# EAGLE design FT231X (EAGLE 7.5.0)
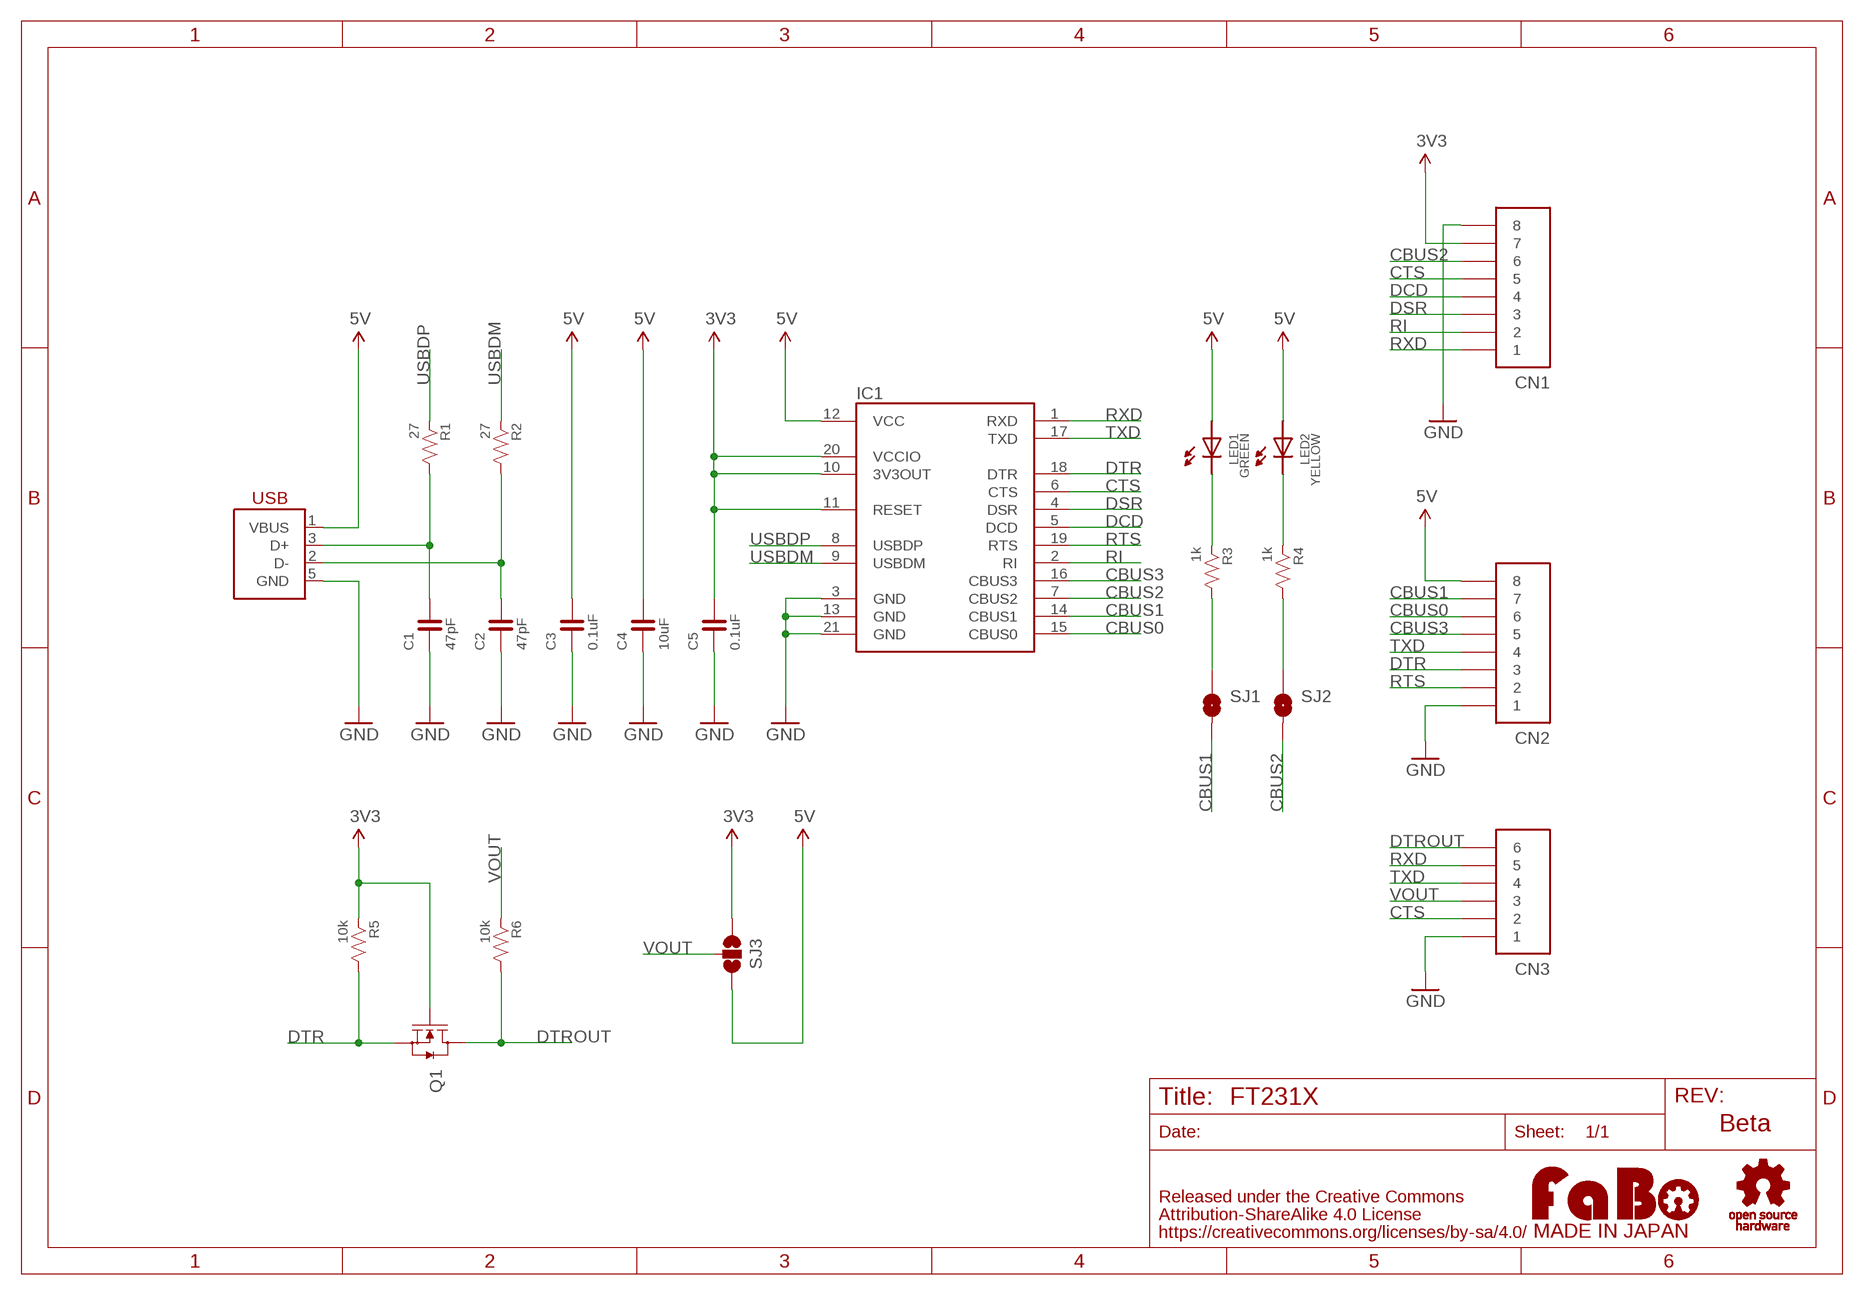
[diagram p0: schematic, sheet 1]

## Parts
C1  47pF  CAPACITOR-0603  [0603]
C2  47pF  CAPACITOR-0603  [0603]
C3  0.1uF  CAPACITOR-0603  [0603]
C4  10uF  CAPACITOR-0603  [0603]
C5  0.1uF  CAPACITOR-0603  [0603]
CN1  PIN_HEADER_1X8-SNEAKY  [PIN_1X8_SNEAKY]
CN2  PIN_HEADER_1X8-SNEAKY  [PIN_1X8_SNEAKY]
CN3  PIN_HEADER_1X6-SNEAKY  [PIN_1X6_SNEAKY]
IC1  FT231XQ  [QFN-20]
LED1  GREEN  LED-0603  [0603]
LED2  YELLOW  LED-0603  [0603]
Q1  MOSFET-N-BSS138  [SOT23-3]
R1  27  RESISTOR-0603  [0603]
R2  27  RESISTOR-0603  [0603]
R3  1k  RESISTOR-0603  [0603]
R4  1k  RESISTOR-0603  [0603]
R5  10k  RESISTOR-0603  [0603]
R6  10k  RESISTOR-0603  [0603]
SJ1  SMD-JUMPER-2_SHORT  [SMD-JUMPER-2-SHORT]
SJ2  SMD-JUMPER-2_SHORT  [SMD-JUMPER-2-SHORT]
SJ3  SMD-JUMPER-3_23SHORT  [SMD-JUMPER-3-23SHORT]
U$2  LOGO_OSHW-T_M_BOTTOM  [LOGO_OSHW_T_MS_BOTTOM]
U$3  LOGO_FABO-S  [LOGO_FABO_S]
USB1  USB-MICRO_B_SMT  [DX4R005JJ2R1800]

## Nets
3V3: C5.2 CN1.7 IC1.10(3V3OUT) IC1.11(RESET) IC1.20(VCCIO) Q1.1(G) R5.1 SJ3.1
5V: C3.2 C4.2 CN2.8 IC1.12(VCC) LED1.ANODE LED2.ANODE SJ3.3 USB1.1(VBUS)
CBUS0: CN2.6 IC1.15(CBUS0)
CBUS1: CN2.7 IC1.14(CBUS1) SJ1.2
CBUS2: CN1.6 IC1.7(CBUS2) SJ2.2
CBUS3: CN2.5 IC1.16(CBUS3)
CTS: CN1.5 CN3.2 IC1.6(CTS)
DCD: CN1.4 IC1.5(DCD)
DSR: CN1.3 IC1.4(DSR)
DTR: CN2.3 IC1.18(DTR) Q1.2(S) R5.2
DTROUT: CN3.6 Q1.3(D) R6.2
GND: C1.1 C2.1 C3.1 C4.1 C5.1 CN1.8 CN2.1 CN3.1 IC1.3(GND) IC1.13(GND) IC1.21(GND) USB1.5(GND)
N$3: C2.2 R2.2 USB1.2(D-)
N$4: C1.2 R1.2 USB1.3(D+)
N$33: LED1.CATHODE R3.1
N$34: R3.2 SJ1.1
N$35: LED2.CATHODE R4.1
N$36: R4.2 SJ2.1
RI: CN1.2 IC1.2(RI)
RTS: CN2.2 IC1.19(RTS)
RXD: CN1.1 CN3.5 IC1.1(RXD)
TXD: CN2.4 CN3.4 IC1.17(TXD)
USBDM: IC1.9(USBDM) R2.1
USBDP: IC1.8(USBDP) R1.1
VOUT: CN3.3 R6.1 SJ3.2

## Notes on the sheet
- Beta

## Library data of the parts
C1-C5 = FaBo-Capacitor:CAPACITOR: CAPACITOR
CN1 CN2 = FaBo-PIN:PIN_HEADER_1X8
CN3 = FaBo-PIN:PIN_HEADER_1X6
IC1 = FaBo-etc:FT231X
LED1 LED2 = FaBo-LED:LED
Q1 = FaBo-etc:MOSFET-N
R1-R6 = FaBo-Resistors:RESISTOR: RESISTOR
SJ1 SJ2 = FaBo-PIN:SMD-JUMPER-2
SJ3 = FaBo-PIN:SMD-JUMPER-3
U$2 = FaBo-etc:LOGO_OSHW
U$3 = FaBo-etc:LOGO_FABO
USB1 = FaBo-etc:USB

## Board
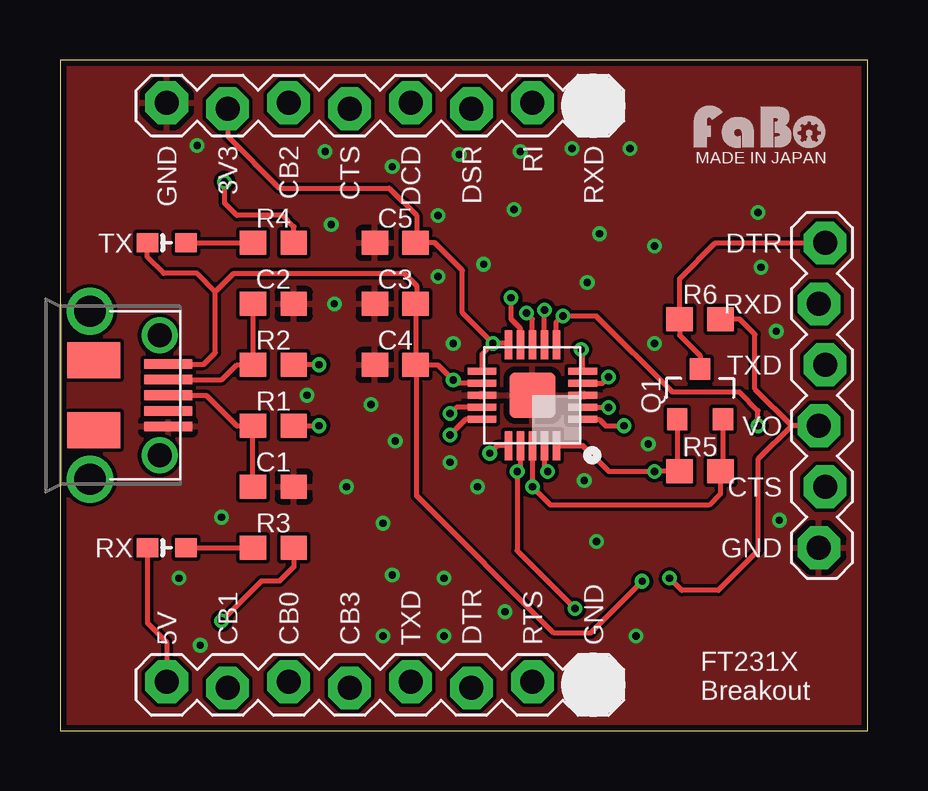
[diagram p1: board, top side]
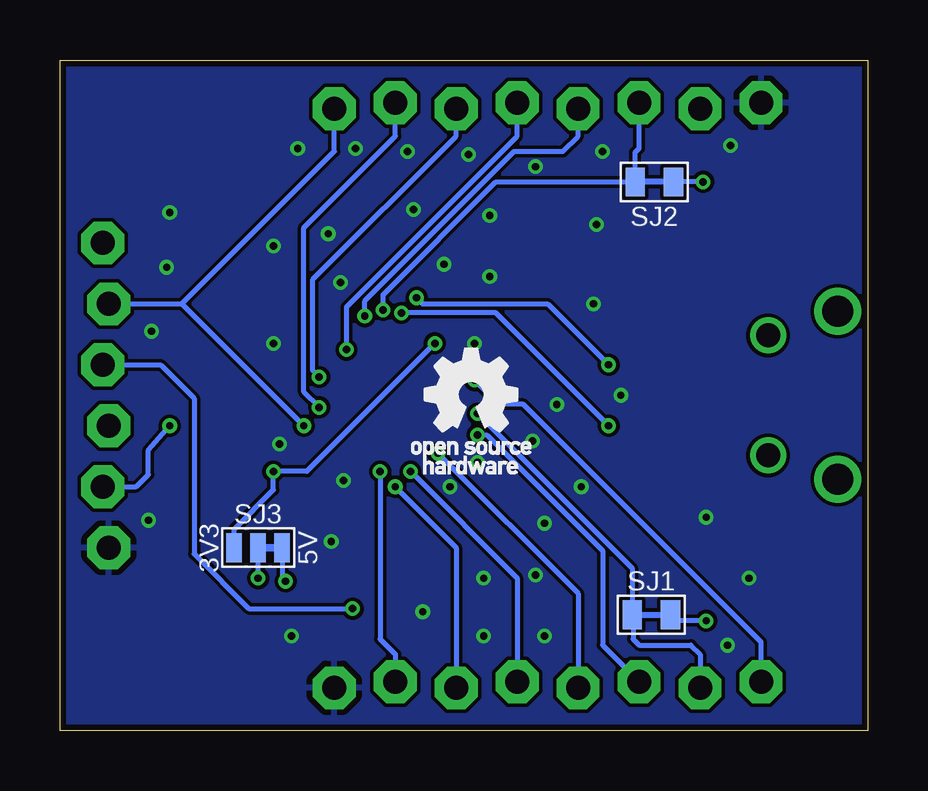
[diagram p2: board, bottom side, seen from below]

Size 33.66 x 27.94 mm. Coordinates in mm from the lower left corner, seen from the top.
Outline: 0,0 33.66,0 33.66,27.94 0,27.93 0,0
Copper layers (1*16): Top 0.035mm / dielectric 1.5mm / Bottom 0.035mm
Design rules "Elecrow_2-layer_eagle_rule": minimum track width 6mil, minimum drill 12mil, track to track 6mil, track to pad 6mil, pad to pad 6mil, via to via 6mil, smd to smd 0mil, copper to edge 10mil, drill to drill 10mil, minimum pad ring 10mil, minimum via ring 6mil, stop-mask expansion 2mil, vias tented up to drill 100mil, thermal gap 10mil

### Footprints (pad centres in the part's own frame; a part is rotated, then mirrored left to right if it is on the bottom)
0603 = smd 1.1 x 1: 1 -0.85,0; 2 0.85,0
PIN_1X8_SNEAKY = drill 1 pad 1.778 octagon: 1 -8.89,0.127; 2 -6.35,-0.127; 3 -3.81,0.127; 4 -1.27,-0.127; 5 1.27,0.127; 6 3.81,-0.127; 7 6.35,0.127; 8 8.89,-0.127
PIN_1X6_SNEAKY = drill 1 pad 1.778 octagon: 1 -6.35,0.127; 2 -3.81,-0.127; 3 -1.27,0.127; 4 1.27,-0.127; 5 3.81,0.127; 6 6.35,-0.127
QFN-20 = smd 1.2 x 0.3: 1 -2.1,1; 2 -2.1,0.5; 3 -2.1,0; 4 -2.1,-0.5; 5 -2.1,-1; 11 2.1,-1; 12 2.1,-0.5; 13 2.1,0; 14 2.1,0.5; 15 2.1,1 | smd 0.3 x 1.2: 6 -1,-2.1; 7 -0.5,-2.1; 8 0,-2.1; 9 0.5,-2.1; 10 1,-2.1; 16 1,2.1; 17 0.5,2.1; 18 0,2.1; 19 -0.5,2.1; 20 -1,2.1 | smd 1.9 x 1.9: 21 0,0
0603' = smd 0.9 x 0.8: ANODE -0.8,0; CATHODE 0.8,0
SOT23-3 = smd 0.85 x 0.9: 1 -0.95,-1; 2 0.95,-1; 3 0,1.1
SMD-JUMPER-2-SHORT = smd 0.8 x 1.2: 1 -0.8,0; 2 0.8,0
SMD-JUMPER-3-23SHORT = smd 0.64 x 1.2: 1 -1,0; 2 0,0; 3 1,0
DX4R005JJ2R1800 = smd 0.4 x 2: 1 -1.3,4.5; 2 -0.65,4.5; 3 0,4.5; 4 0.65,4.5; 5 1.3,4.5 | smd 1.5 x 2.2: 6 -1.45,1.4; 7 1.45,1.4 | drill 1 pad 1.4: P$1 -2.5,4.15; P$2 2.5,4.15 | drill 1.3 pad 1.7: P$3 -3.5,1.25; P$4 3.5,1.25

### Placement (x,y rotation side)
C1  8.89,10.16 180 top
C2  8.89,17.78 180 top
C3  13.97,17.78 0 top
C4  13.97,15.24 0 top
C5  13.97,20.32 0 top
CN1  13.34,26.04 180 top
CN2  13.34,1.91 180 top
CN3  31.75,13.97 90 top
IC1  19.68,13.97 180 top
LED1  GREEN  [0603']  4.45,7.62 0 top
LED2  YELLOW  [0603']  4.45,20.32 0 top
Q1  26.67,13.97 0 top
R1  8.89,12.7 180 top
R2  8.89,15.24 180 top
R3  8.89,7.62 0 top
R4  8.89,20.32 0 top
R5  26.67,10.79 0 top
R6  26.67,17.14 180 top
SJ1  9.02,4.83 0 bottom
SJ2  8.89,22.86 180 bottom
SJ3  25.4,7.62 0 bottom
U$2  16.51,13.97 0 top
U$3  29.21,24.13 0 top
USB1  0,13.97 270 top

### Tracks (layer width: path | path; a pad name or v marks a point on that pad's centre or on a via)
3V3  (via drill 0.3)
  Top 0.203: IC1.11 17.59,15.68 v18.03,16.13 | IC1.10 18.63,16.13 v18.03,16.13 | CN1.7 6.99,24.77 9.14,22.61 13.72,22.61 14.86,21.46 14.86,20.36 C5.2 15.62,20.32 16.76,19.18 16.76,17.4 v18.03,16.13 | Q1.1 25.72,10.89 R5.1 v24.77,10.79 22.86,10.79 21.79,11.87 IC1.20
  Bottom 0.203: SJ3.1 26.4,8.4 24.77,10.03 v24.77,10.79 23.37,10.79 v18.03,16.13
5V  (via drill 0.3)
  Top 0.203: USB1.1 6,15.27 6.48,15.75 6.48,18.29 | 6.48,18.29 7.24,19.05 14.35,19.05 14.86,18.54 14.86,17.82 C3.2 C4.2 | C4.2 15.75,15.24 v16.38,14.61 16.51,14.48 IC1.12 | v24.26,6.22 22.1,4.06 20.57,4.06 14.86,9.78 14.86,15.2 C4.2 | LED1.ANODE 3.65,4.48 4.45,3.68 CN2.8 | 6.48,18.29 5.71,19.05 4.32,19.05 3.65,19.72 LED2.ANODE
  Bottom 0.203: v16.38,14.61 15.37,13.59 14.35,13.59 4.45,3.68 CN2.8 | SJ3.3 24.4,6.37 v24.26,6.22
CBUS0  (via drill 0.3)
  Top 0.203: IC1.15 16.91,12.97 v16.26,12.32
  Bottom 0.203: v16.26,12.32 15.88,12.32 11.05,7.49 11.05,3.56 CN2.6
CBUS1  (via drill 0.3)
  Top 0.203: IC1.14 16.52,13.47 v16.26,13.21
  Bottom 0.203: v16.26,13.21 9.82,6.77 9.82,4.83 | SJ1.2 9.78,4.83 9.78,3.81 9.53,3.56 7.37,3.56 6.99,3.17 CN2.7
CBUS2  (via drill 0.3)
  Top 0.203: IC1.7 v20.18,17.53 v20.19,17.53
  Bottom 0.203: v20.19,17.53 20.19,18.16 15.49,22.86 SJ2.2 9.69,24.09 9.53,24.26 CN1.6
CBUS3  (via drill 0.3)
  Top 0.203: IC1.16 18.22,11.87 v17.91,11.56
  Bottom 0.203: v17.91,11.56 12.06,5.71 CN2.5
CTS  (via drill 0.3)
  Top 0.203: IC1.6 20.68,17.03 v20.95,17.27 22.35,17.27 25.53,14.1 28.32,14.1 29.08,13.34 v29.08,12.7
  Bottom 0.203: CN1.5 12.06,24.77 12.7,24.13 14.73,24.13 20.95,17.91 v20.95,17.27 | CN3.2 30.48,10.16 29.97,10.67 29.97,11.68 v29.08,12.7
DCD  (via drill 0.3)
  Top 0.203: IC1.5 21.79,15.81 v21.72,15.88
  Bottom 0.203: v21.72,15.88 21.72,17.65 14.61,24.77 CN1.4
DSR  (via drill 0.3)
  Top 0.203: IC1.4 22.6,14.47 v22.86,14.73
  Bottom 0.203: v22.86,14.73 23.11,14.99 23.11,18.8 17.14,24.77 CN1.3
DTR  (via drill 0.3)
  Top 0.203: IC1.18 v19.68,10.16 20.45,9.4 27.05,9.4 27.52,9.87 R5.2 27.62,10.89 Q1.2
  Bottom 0.203: v19.68,10.16 17.14,7.62 CN2.3
DTROUT
  Top 0.203: Q1.3 26.67,15.62 25.82,16.47 R6.2 25.82,18.84 27.3,20.32 CN3.6
GND  (via drill 0.3)
  other vias: 16.64,24 19.18,24.13 21.34,24.26 21.97,18.67 22.48,20.7 24.77,20.19 18.92,21.72 13.84,23.5 11.05,24.13 15.75,21.46 17.65,19.43 23.75,24.26 11.3,21.08 11.43,17.78 16.38,16.13 15.75,18.92 24.51,11.94 24.77,16.13 16.26,11.18 13.97,12.06 12.95,13.59 10.29,13.97 11.94,10.16 13.46,8.64 17.4,10.16 13.84,6.48 16,6.35 18.54,4.95 21.84,10.41 24,3.94 13.46,3.94 16,3.94 4.95,6.35 5.84,3.56 6.73,8.89 5.71,24.38 22.35,7.87 29.08,21.59 29.21,19.3 29.84,16.64 29.97,8.76
  pour Bottom: 0,0 33.66,0 33.66,27.94 0,27.94
  pour Top: 0,0 33.66,0 33.66,27.94 0,27.94
N$3
  Top 0.203: C2.2 R2.2 7.37,15.24 6.75,14.62 USB1.2
N$4
  Top 0.203: C1.2 R1.2 7.37,12.7 6.1,13.97 USB1.3
N$33
  Top 0.203: LED1.CATHODE R3.1
N$34  (via drill 0.3)
  Top 0.203: R3.2 9.74,6.82 9.14,6.22 8.38,6.22 v6.73,4.57
  Bottom 0.203: v6.73,4.57 7.96,4.57 8.22,4.83
N$35
  Top 0.203: LED2.CATHODE R4.1
N$36  (via drill 0.3)
  Top 0.203: R4.2 9.74,20.99 9.27,21.46 7.37,21.46 6.86,21.97 v6.86,22.86
  Bottom 0.203: v6.86,22.86 SJ2.1
RI  (via drill 0.3)
  Top 0.203: IC1.2 v22.85,13.47 v22.86,13.46
  Bottom 0.203: CN1.2 19.68,24.77 23.5,20.95 23.5,14.1 v22.86,13.46
RTS  (via drill 0.3)
  Top 0.203: IC1.19 20.18,10.93 v20.32,10.79
  Bottom 0.203: v20.32,10.79 20.32,3.81 19.68,3.17 CN2.2
RXD  (via drill 0.3)
  Top 0.203: IC1.1 22.46,12.97 22.73,12.7 v23.5,12.7
  Bottom 0.203: CN3.5 28.57,17.78 | 28.57,17.78 v23.5,12.7 | 28.57,17.78 22.23,24.13 CN1.1
TXD  (via drill 0.3)
  Top 0.203: IC1.17 19.18,10.93 v19.05,10.79 19.05,7.49 v21.46,5.08
  Bottom 0.203: v19.05,10.79 14.61,6.35 CN2.4 | CN3.4 29.46,15.24 28.07,13.84 28.07,7.37 25.78,5.08 v21.46,5.08
USBDM  (via drill 0.3)
  Top 0.203: IC1.9 19.18,16.76 18.8,17.14 v18.8,18.03 | v10.79,15.24 R2.1
  Bottom 0.203: v18.8,18.03 18.54,17.78 13.34,17.78 v10.79,15.24
USBDP  (via drill 0.3)
  Top 0.203: IC1.8 19.68,17.14 v19.43,17.4 | R1.1 v10.79,12.7
  Bottom 0.203: v10.79,12.7 15.49,17.4 v19.43,17.4
VOUT  (via drill 0.3)
  Top 0.203: CN3.3 30.48,12.7 | R6.1 28.32,17.14 28.96,16.51 28.96,14.22 30.48,12.7 | v25.4,6.35 25.91,5.84 27.43,5.84 29.08,7.49 29.08,11.3 30.48,12.7
  Bottom 0.203: v25.4,6.35 SJ3.2

### Text on the board
tPlace: GND | 3V3 | CB2 | CTS | DCD | DSR | RI | RXD | MADE IN JAPAN | TX | DTR | RXD | TXD | VO | CTS | RX | GND | 5V | CB1 | CB0 | CB3 | TXD | DTR | RTS | GND | FT231X / Breakout
bPlace: 5V | 3V3